# Altium schematic sheet POWER_MANAGER.SchDoc
size 420 x 297 mm; SheetNumber: 6; SheetTotal: 34
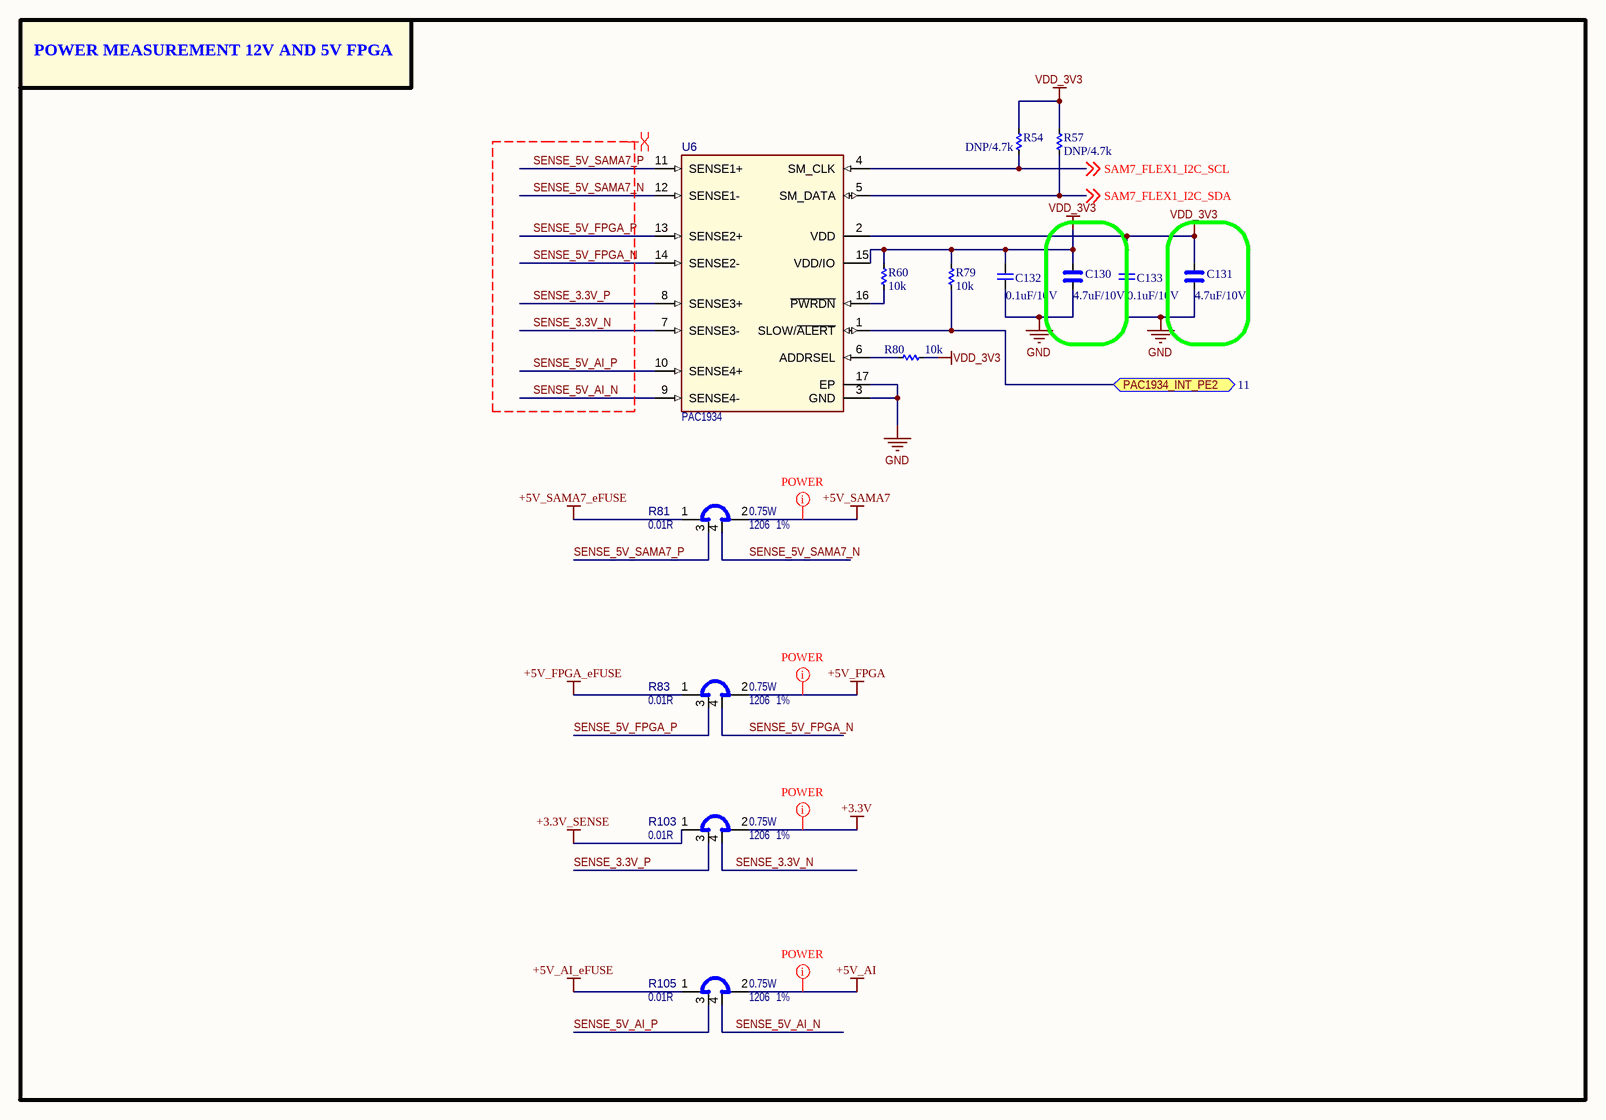
[diagram p0: POWER_MANAGER.SchDoc]

## Parts
C130  4.7uF/10V  [CAP_C_1005X50_L]
C131  4.7uF/10V  [CAP_C_1005X50_L]
C132  0.1uF/10V  [CAP_C_1005X50_L]
C133  0.1uF/10V  [CAP_C_1005X50_L]
R54  DNP/4.7k  [RES_C_1005x30_L]
R57  DNP/4.7k  [RES_C_1005x30_L]
R60  10k  [RES_C_1005x30_L]
R79  10k  [RES_C_1005x30_L]
R80  10k  [RES_C_1005x30_L]
R81  value 0.01R  Package: 1206  Tolerance: 1%  Power: 0.75W  [RES_C_1206_SHUNT]  (hidden comment: KRL1632E-M-R010-F-T5)
R83  value 0.01R  Package: 1206  Tolerance: 1%  Power: 0.75W  [RES_C_1206_SHUNT]  (hidden comment: KRL1632E-M-R010-F-T5)
R103  value 0.01R  Package: 1206  Tolerance: 1%  Power: 0.75W  [RES_C_1206_SHUNT]  (hidden comment: KRL1632E-M-R010-F-T5)
R105  value 0.01R  Package: 1206  Tolerance: 1%  Power: 0.75W  [RES_C_1206_SHUNT]  (hidden comment: KRL1632E-M-R010-F-T5)
U6  value PAC1934  [UQFN-16_4X4_EP2.6X2.6]  (hidden comment: PAC1934 UQFN-16)

## Blocks framed on the sheet
POWER MEASUREMENT 12V AND 5V FPGA: C130-C133 R54 R57 R60 R79-R81 R83 R103 R105 U6

## Ports
PAC1934_INT_PE2 (bidir, see 11)

## Nets
+3.3V: R103.2
+3.3V_SENSE: R103.1
+5V_AI: R105.2
+5V_AI_eFUSE: R105.1
+5V_FPGA: R83.2
+5V_FPGA_eFUSE: R83.1
+5V_SAMA7: R81.2
+5V_SAMA7_eFUSE: R81.1
GND: C130.2 C131.2 C132.2 C133.2 U6.3(GND) U6.17(EP)
VDD_3V3: C130.1 C131.1 C132.1 C133.1 R54.1 R57.1 R60.1 R79.1 R80.2 U6.2(VDD) U6.15(VDD/IO)
PAC1934_INT_PE2: R79.2 U6.1(SLOW/~{ALERT}) ; port PAC1934_INT_PE2
SAM7_FLEX1_I2C_SCL: R54.2 U6.4(SM_CLK) ; off-sheet SAM7_FLEX1_I2C_SCL
SAM7_FLEX1_I2C_SDA: R57.2 U6.5(SM_DATA) ; off-sheet SAM7_FLEX1_I2C_SDA
SENSE_3.3V_N: R103.4 U6.7(SENSE3-)
SENSE_3.3V_P: R103.3 U6.8(SENSE3+)
SENSE_5V_AI_N: R105.4 U6.9(SENSE4-)
SENSE_5V_AI_P: R105.3 U6.10(SENSE4+)
SENSE_5V_FPGA_N: R83.4 U6.14(SENSE2-)
SENSE_5V_FPGA_P: R83.3 U6.13(SENSE2+)
SENSE_5V_SAMA7_N: R81.4 U6.12(SENSE1-)
SENSE_5V_SAMA7_P: R81.3 U6.11(SENSE1+)
NetR60_2: R60.2 U6.16(~{PWRDN})
NetR80_1: R80.1 U6.6(ADDRSEL)

## Layout directives
net class POWER: +3.3V, +5V_AI, +5V_FPGA, +5V_SAMA7
differential pair; net class DIFF100; differential pair class DIFF100: SENSE_3.3V_N, SENSE_3.3V_P, SENSE_5V_AI_N, SENSE_5V_AI_P, SENSE_5V_FPGA_N, SENSE_5V_FPGA_P, SENSE_5V_SAMA7_N, SENSE_5V_SAMA7_P

## Notes on the sheet
- Project:
- Sub-system:
- Design by:
- Sheet title:
- Sheet
- of
- Checked by:
- Approved by:
- Revision:
- Document No:
- Size:
- Date:
- A3

## Library data of the parts
C130 C131 = _CAP_C_High_2: CAP
C132 C133 = _CAP_C_2: CAP
R54 R57 R60 R79 R80 = _RES_B_2: RES
R81 R83 R103 R105 = RSMT1316: Shunt; Manufacturer 1: SUSUMU; Description_: RES SHUNT MF 0.01R 1% 0.75W SMD 1206; Dev Tools Status: Design; Temperature Coeffcient: 50ppm/C; Current: 8A; Owner: Ciprian Abramov; Populated: YES; MCHP-ID: RSMT1316; Revision: 1; Symbol: Shunt 4 Pin; Status: MCL Design; ComponentLink1URL: https://chn-vm-apps.microchip.com/mchprepo/parts/Datasheets/n_catalog_partition09_en.pdf; ComponentLink1Description: SVN Datasheet; ComponentLink2URL: C:\ALTIUM_WORK\00001_MCHP-CDB\Datasheets\n_catalog_partition09_en.pdf; ComponentLink2Description: Local Datasheet; ComponentLink3URL: C:\ALTIUM_WORK\00001_MCHP-CDB\Library\LibraryRefs\Shunt 4 Pin.SchLib; ComponentLink3Description: Open Symbol; ComponentLink4URL: C:\ALTIUM_WORK\00001_MCHP-CDB\Library\Footprints\RES_C_1206_SHUNT.PcbLib; ComponentLink4Description: Open Footprint; ComponentLink5Description: Open Footprint 2; ComponentLink6Description: Open Footprint 3; ComponentLink7Description: Open Footprint 4; Operating Temperature: -55C to +155C; Category: Resistor; Type: RES SMD; Composition: MF; Manufacturer Part Number 1: KRL1632E-M-R010-F-T5; Supplier 1: Digi-Key; Supplier Part Number 1: 408-1570-1-ND; Quantity Override: 1
U6 = MIC8883: Manufacturer 1: Microchip Technology; Manufacturer Part Number 1: PAC1934T-I/JQ; Description_: MCHP ANALOG POWER CURRENT SENSE MONITOR PAC1934T-I/JQ UQFN-16; Dev Tools Status: Design; Owner: Ciprian Abramov; Populated: YES; MCHP-ID: MIC8883; Symbol: PAC1934 UQFN-16; Type: Power/Current Sensor; Status: MCL Design; Revision: 1; Category: MCHP-Analog; ComponentLink1Description: SVN Datasheet; ComponentLink2Description: Local Datasheet; ComponentLink3URL: C:\ALTIUM_WORK\00001_MCHP-CDB\Library\LibraryRefs\PAC1934 UQFN-16.SchLib; ComponentLink3Description: Open Symbol; ComponentLink4URL: C:\ALTIUM_WORK\00001_MCHP-CDB\Library\Footprints\UQFN-16_4X4_EP2.6X2.6.PcbLib; ComponentLink4Description: Open Footprint; ComponentLink5Description: Open Footprint 2; ComponentLink6Description: Open Footprint 3; ComponentLink7Description: Open Footprint 4; Supplier 1: Digi-Key; Supplier Part Number 1: PAC1934T-I/JQCT-ND; Quantity Override: 1